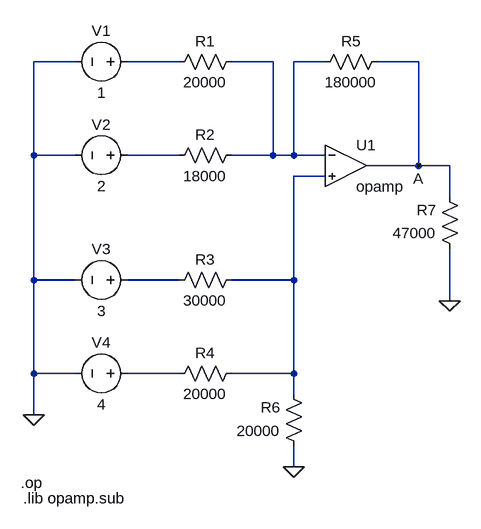
[diagram p0: schematic Draft1.asc]
Draft1.asc, the LTspice schematic file:
Version 4
SHEET 1 880 680
WIRE -208 -336 -272 -336
WIRE -48 -336 -128 -336
WIRE 96 -336 32 -336
WIRE 176 -336 128 -336
WIRE 320 -336 256 -336
WIRE -272 -192 -272 -336
WIRE -208 -192 -272 -192
WIRE -48 -192 -128 -192
WIRE 96 -192 96 -336
WIRE 96 -192 32 -192
WIRE 128 -192 128 -336
WIRE 128 -192 96 -192
WIRE 176 -192 128 -192
WIRE 320 -176 320 -336
WIRE 320 -176 240 -176
WIRE 368 -176 320 -176
WIRE 176 -160 128 -160
WIRE 368 -128 368 -176
WIRE -272 0 -272 -192
WIRE -208 0 -272 0
WIRE -48 0 -128 0
WIRE 128 0 128 -160
WIRE 128 0 32 0
WIRE 368 32 368 -48
WIRE -272 144 -272 0
WIRE -208 144 -272 144
WIRE -48 144 -128 144
WIRE 128 144 128 0
WIRE 128 144 32 144
WIRE 128 176 128 144
WIRE -272 208 -272 144
WIRE 128 288 128 256
FLAG -272 208 0
FLAG 128 288 0
FLAG 368 32 0
FLAG 320 -176 A
SYMBOL res 48 -352 R90
WINDOW 0 0 56 VBottom 2
WINDOW 3 32 56 VTop 2
SYMATTR InstName R1
SYMATTR Value 20000
SYMBOL res 48 -208 R90
WINDOW 0 0 56 VBottom 2
WINDOW 3 32 56 VTop 2
SYMATTR InstName R2
SYMATTR Value 18000
SYMBOL res 48 -16 R90
WINDOW 0 0 56 VBottom 2
WINDOW 3 32 56 VTop 2
SYMATTR InstName R3
SYMATTR Value 30000
SYMBOL res 48 128 R90
WINDOW 0 0 56 VBottom 2
WINDOW 3 32 56 VTop 2
SYMATTR InstName R4
SYMATTR Value 20000
SYMBOL res 272 -352 R90
WINDOW 0 0 56 VBottom 2
WINDOW 3 32 56 VTop 2
SYMATTR InstName R5
SYMATTR Value 180000
SYMBOL res 144 272 R180
WINDOW 0 36 76 Left 2
WINDOW 3 36 40 Left 2
SYMATTR InstName R6
SYMATTR Value 20000
SYMBOL res 384 -32 R180
WINDOW 0 36 76 Left 2
WINDOW 3 36 40 Left 2
SYMATTR InstName R7
SYMATTR Value 47000
SYMBOL Opamps\\opamp 208 -240 R0
SYMATTR InstName U1
SYMBOL voltage -112 -336 R90
WINDOW 0 -32 56 VBottom 2
WINDOW 3 32 56 VTop 2
WINDOW 123 0 0 Left 0
WINDOW 39 0 0 Left 0
SYMATTR InstName V1
SYMATTR Value 1
SYMBOL voltage -112 -192 R90
WINDOW 0 -32 56 VBottom 2
WINDOW 3 32 56 VTop 2
WINDOW 123 0 0 Left 0
WINDOW 39 0 0 Left 0
SYMATTR InstName V2
SYMATTR Value 2
SYMBOL voltage -112 0 R90
WINDOW 0 -32 56 VBottom 2
WINDOW 3 32 56 VTop 2
WINDOW 123 0 0 Left 0
WINDOW 39 0 0 Left 0
SYMATTR InstName V3
SYMATTR Value 3
SYMBOL voltage -112 144 R90
WINDOW 0 -32 56 VBottom 2
WINDOW 3 32 56 VTop 2
WINDOW 123 0 0 Left 0
WINDOW 39 0 0 Left 0
SYMATTR InstName V4
SYMATTR Value 4
TEXT -292 312 Left 2 !.op
TEXT -288 336 Left 2 !.lib opamp.sub

The netlist it stands for:
* Draft1.asc
R1 N002 N001 20000
R2 N002 N003 18000
R3 N004 N005 30000
R4 N004 N006 20000
R5 A N002 180000
R6 0 N004 20000
R7 0 A 47000
XU1 N002 N004 A opamp Aol=100K GBW=10Meg  ; pins invin noninvin out
V1 N001 0 1
V2 N003 0 2
V3 N005 0 3
V4 N006 0 4
.op
.lib opamp.sub
.backanno
.end